# EAGLE design DotPhat (EAGLE 7.7.0)
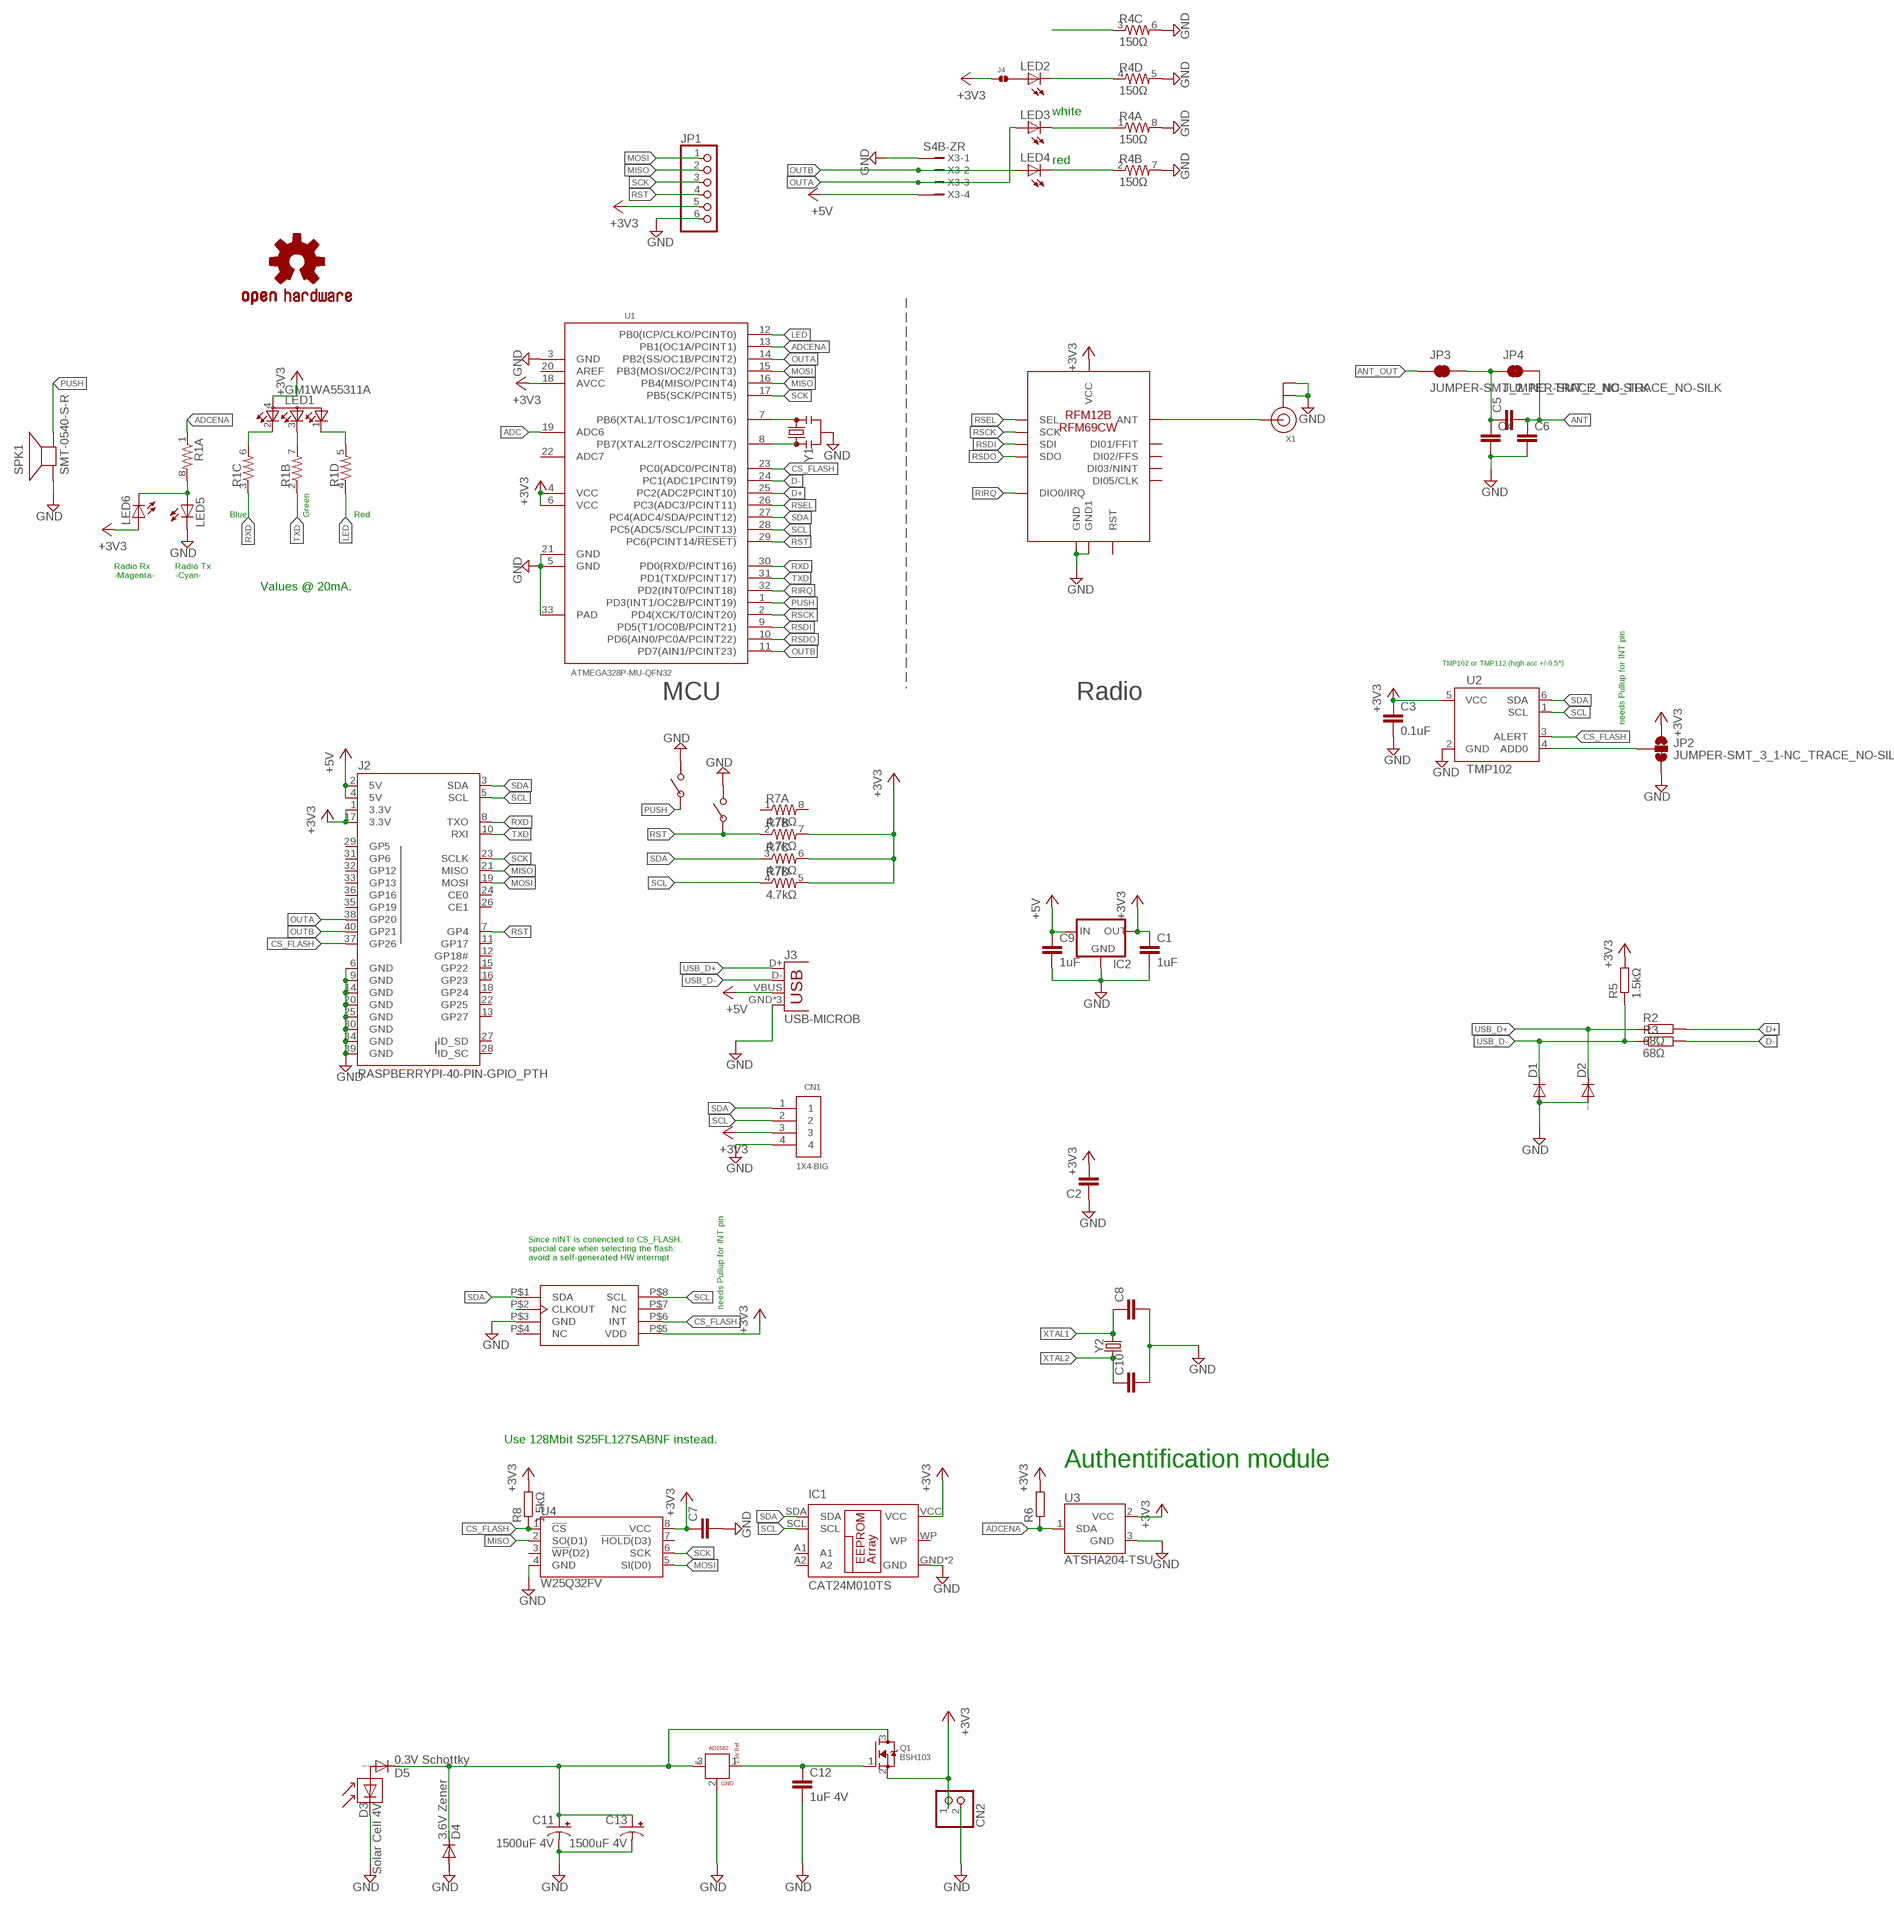
[diagram p0: schematic, sheet 1]

## Parts
C1  1uF  C-EUC0603  [C0603]
C2  C-EUC3216  [C3216]
C3  0.1uF  C-EUC0603  [C0603]
C4  C-EUC0603  [C0603]
C5  C-EUC0603  [C0603]
C6  C-EUC0603  [C0603]
C7  C-EUC0603  [C0603]
C8  C-EUC0402  [C0402]
C9  1uF  C-EUC0603  [C0603]
C10  C-EUC0402  [C0402]
C11  1500uF 4V  CPOL-USCT7343  [CT7343]
C12  1uF 4V  C-EUC0603  [C0603]
C13  1500uF 4V  CPOL-USCT7343  [CT7343]
CN1  1X4-BIG  [1X04-BIG]
CN2  JST_2PIN-SMT-RA  [JST-PH-2-SMT-RA]
D1  DIODE-SOD523  [SOD523]
D2  DIODE-SOD523  [SOD523]
D3  Solar Cell 4V  SOLAR-IXYS-  [SOLARBIT-12X1]
D4  3.6V Zener  DIODE-SOD523  [SOD523]
D5  0.3V Schottky  DIODE-SOD523  [SOD523]
IC1  CAT24M010TS  [TSSOP8]
IC2  MCP1700TT  [SOT-23]
J2  RASPBERRYPI-40-PIN-GPIO_PTH  [2X20_SHROUDED]
J3  USB-MICROB  [USB-MICROB]
J4  SOLDERJUMPER.2.MED  [2.MED]
JP1  PINHD-1X6  [1X06]
JP2  JUMPER-SMT_3_1-NC_TRACE_NO-SILK  [SMT-JUMPER_3_1-NC_TRACE_NO-SILK]
JP3  JUMPER-SMT_2_NC_TRACE_NO-SILK  [SMT-JUMPER_2_NC_TRACE_NO-SILK]
JP4  JUMPER-SMT_2_NC_TRACE_NO-SILK  [SMT-JUMPER_2_NC_TRACE_NO-SILK]
LED1  GM1WA55311A  [GM1WA55311A]
LED2  LED0603  [LED-0603]
LED3  LED0603  [LED-0603]
LED4  LED0603  [LED-0603]
LED5  LED0603  [LED-0603]
LED6  LED0603  [LED-0603]
LOGO1  OSHW-LOGOS  [OSHW-LOGO-S]
Q1  BSH103  MOSFET-NREFLOW  [SOT23]
R1  RESISTOR-ARRAY0603-ARV  [0603-ARV]
R2  68Ω  R-EU_R0603  [R0603]
R3  68Ω  R-EU_R0603  [R0603]
R4  150Ω  RESISTOR-ARRAY0603-ARV  [0603-ARV]
R5  1.5kΩ  R-EU_R0603  [R0603]
R6  R-EU_R0603  [R0603]
R7  4.7kΩ  RESISTOR-ARRAY0603-ARV  [0603-ARV]
R8  1.5kΩ  R-EU_R0603  [R0603]
SPK1  SMT-0540-S-R  [SMT-0540-S-R]
U1  ATMEGA328P-MU-QFN32  MCU-ATMEGA328P-MU(QFN32)  [QFN32G-0.5-5X5MM]
U2  TMP102  [SOT563]
U3  ATSHA204-TSU  [SOT23-3]
U4  W25Q32FV  W25Q32FVZP  [WSON8-6X5MM]
U$1  RFM12B/69CW  [RFM12B/69CW]
U$2  PUSHBUTTON_4X2.5  [PUSHBUTTON_4X2.5]
U$3  PUSHBUTTON_4X2.5  [PUSHBUTTON_4X2.5]
U$4  AD1582  [SOT23]
X1  ANTENNA_U.FL  [U.FL]
X2  MC-RTC-RV-4162-C7-I2C  [MC-RTC-C7]
X3  S4B-ZR  [S4B-ZR]
Y1  RESONATORSMD-3.2X1.3  [RESONATOR-SMD-3.2X1.3]
Y2  CRYSTALSMD-3.2X1.5  [CRYSTAL-SMD-3.2X1.5MM]

## Nets
+3V3: C1.1 C2.2 C3.1 C7.1 CN1.3 CN2.1 IC1.VCC IC2.2(OUT) J2.1(3.3V) J2.17(3.3V) J4.1 JP1.5 JP2.1 LED1.4(A) LED6.A Q1.2(S) R5.2 R6.2 R7.5 R7.6 R7.7 R8.2 U1.4(VCC) U1.6(VCC) U1.18(AVCC) U2.5(VCC) U3.2(VCC) U4.8(VCC) U$1.VDD(VCC) X2.P$5(VDD)
+5V: C9.1 IC2.3(IN) J2.2(5V) J2.4(5V) J3.VBUS X3.4
ADC: U1.19(ADC6)
ADCENA: R1.1 R6.1 U1.13(PB1(OC1A/PCINT1)) U3.1(SDA)
ANT: C5.2 C6.1 JP4.2
ANT_OUT: JP3.1 U$1.ANT X1.3(SIGNAL)
CAPS_VCC: C11.+ C13.+ D4.C D5.C Q1.3(D) U$4.3
CS_FLASH: J2.37(GP26) R8.1 U1.23(PC0(ADC0/PCINT8)) U2.3(ALERT) U4.1(!CS!) X2.P$6(INT)
D+: R2.2 U1.25(PC2(ADC2PCINT10))
D-: R3.2 U1.24(PC1(ADC1PCINT9))
GND: C1.2 C2.1 C3.2 C4.2 C6.2 C7.2 C8.2 C9.2 C10.2 C11.- C12.2 C13.- CN1.4 CN2.2 D1.A D2.A D3.-(C) D4.A IC1.GND IC1.NC(GND) IC2.1(GND) J2.6(GND) J2.9(GND) J2.14(GND) J2.20(GND) J2.25(GND) J2.30(GND) J2.34(GND) J2.39(GND) J3.GND J3.MT1(GND) J3.MT2(GND) JP1.6 JP2.3 LED5.C R4.5 R4.6 R4.7 R4.8 SPK1.-(+) U1.3(GND) U1.5(GND) U1.21(GND) U1.33(PAD) U2.2(GND) U3.3(GND) U4.4(GND) U$1.GND U$1.GND1 U$2.P$2 U$3.P$2 U$4.2 X1.1(GND) X1.2(GND) X2.P$3(GND) X3.1 Y1.2
LED: R1.4 U1.12(PB0(ICP/CLKO/PCINT0))
MISO: J2.21(MISO) JP1.2 U1.16(PB4(MISO/PCINT4)) U4.2(SO(D1))
MOSFET: C12.1 Q1.1(G) U$4.1
MOSI: J2.19(MOSI) JP1.1 U1.15(PB3(MOSI/OC2/PCINT3)) U4.5(SI(D0))
N$1: LED1.3(CBLUE) R1.7
N$2: LED3.C R4.1
N$3: C4.1 C5.1 JP3.2 JP4.1
N$4: LED1.2(CRED) R1.6
N$5: D3.+(A) D5.A
N$6: U1.7(PB6(XTAL1/TOSC1/PCINT6)) Y1.3
N$7: LED2.C R4.4
N$8: U1.8(PB7(XTAL2/TOSC2/PCINT7)) Y1.1
N$9: LED4.C R4.2
N$10: R4.3
N$11: JP2.2 U2.4(ADD0)
N$12: J4.2 LED2.A
N$13: LED5.A LED6.C R1.8
N$15: LED1.1(CGREEN) R1.5
OUTA: J2.38(GP20) LED3.A U1.14(PB2(SS/OC1B/PCINT2)) X3.3
OUTB: J2.40(GP21) LED4.A U1.11(PD7(AIN1/PCINT23)) X3.2
PUSH: SPK1.+(-) U1.1(PD3(INT1/OC2B/PCINT19)) U$3.P$1
RIRQ: U1.32(PD2(INT0/PCINT18)) U$1.IRQ(DIO0/IRQ)
RSCK: U1.2(PD4(XCK/T0/CINT20)) U$1.SCK
RSDI: U1.9(PD5(T1/OC0B/PCINT21)) U$1.SDI
RSDO: U1.10(PD6(AIN0/PC0A/PCINT22)) U$1.SDO
RSEL: U1.26(PC3(ADC3/PCINT11)) U$1.SEL
RST: J2.7(GP4) JP1.4 R7.2 U1.29(PC6(PCINT14/!RESET)) U$2.P$1
RXD: J2.8(TXO) R1.3 U1.30(PD0(RXD/PCINT16))
SCK: J2.23(SCLK) JP1.3 U1.17(PB5(SCK/PCINT5)) U4.6(SCK)
SCL: CN1.2 IC1.SCL J2.5(SCL) R7.4 U1.28(PC5(ADC5/SCL/PCINT13)) U2.1(SCL) X2.P$8(SCL)
SDA: CN1.1 IC1.SDA J2.3(SDA) R7.3 U1.27(PC4(ADC4/SDA/PCINT12)) U2.6(SDA) X2.P$1(SDA)
TXD: J2.10(RXI) R1.2 U1.31(PD1(TXD/PCINT17))
USB_D+: D2.C J3.D+ R2.1
USB_D-: D1.C J3.D- R3.1 R5.1
XTAL1: C8.1 Y2.P$2
XTAL2: C10.1 Y2.P$1
Unconnected: IC1.A1 IC1.A2 IC1.WP J2.11(GP17) J2.12(GP18#) J2.13(GP27) J2.15(GP22) J2.16(GP23) J2.18(GP24) J2.22(GP25) J2.24(CE0) J2.26(CE1) J2.27(ID_SD) J2.28(ID_SC) J2.29(GP5) J2.31(GP6) J2.32(GP12) J2.33(GP13) J2.35(GP19) J2.36(GP16) R7.1 R7.8 U1.20(AREF) U1.22(ADC7) U4.3(!WP!(D2)) U4.7(!HOLD!(D3)) U$1.CLK(DI05/CLK) U$1.FFIT(DI01/FFIT) U$1.FFS(DI02/FFS) U$1.NINT(DI03/NINT) U$1.RST X2.P$2(CLKOUT) X2.P$4(NC) X2.P$7(NC)

## Notes on the sheet
- white
- red
- Blue | Green | Red
- Radio Rx
  -Magenta-
- Radio Tx
  -Cyan-
- Values @ 20mA.
- TMP102 or TMP112 (high acc +/-0.5°)
- MCU | Radio
- needs Pullup for INT pin
- Since nINT is conencted to CS_FLASH,
  special care when selecting the flash:
  avoid a self-generated HW interrupt
- needs Pullup for INT pin
- Use 128Mbit S25FL127SABNF instead.
- Authentification module

## Library data of the parts
C1 C2 C4-C10 C12 = rcl:C-EU: CAPACITOR, European symbol
C3 = resistor:C-EU: CAPACITOR, European symbol
C11 C13 = adafruit:CPOL-US: POLARIZED CAPACITOR, American symbol
CN1 = adafruit:1X4: 4-pin connector
CN2 = adafruit:JST_2PIN: JST 2-Pin Connectors of various flavors SMT-RA (S2B-PH-SM4) 4UConnector #17311 SMT (B2B-PH-SM4) THM-RA (S2B-PH) THM (B2B-PH)
D1 D2 D4 D5 = diode:DIODE-: DIODE
D3 = SparkFun:SOLAR-IXYS
IC1 = CAT24M01YI:CAT24M01: Serial EEPROM 1Mb, I2C; MF: On Semiconductor; MPN: 24C00T-E/ST
IC2 = MCP1700:MCP1700: Microchip MCP1700 positive regulator
J2 = SparkFun-Connectors:RASPBERRYPI-40-PIN-GPIO: Raspberry Pi GPIO Header 2x20 pin connector, as found on B, B+, A+ models. Both shrouded PTH and SMT versions available. SparkFun Products: GPIO Shrouded Header <https://www.sparkfun.com/products/13054>- PTH SparkFun Pi Wedge (Preassembled) <https://www.sparkfun.com/products/13717>; PROD_ID: CONN-12263; SF_ID: PRT-13054
J3 = SparkFun-Retired:USB: USB Connectors USB-B-PTH is fully proven SKU : PRT-00139/CONN-08278 USB-miniB is fully proven SKU : PRT-00587 USB-A-PCB is untested. USB-A-H is throughly reviewed, but untested. Spark Fun Electronics SKU : PRT-00437 USB-B-SMT is throughly reviewed, but untested. Needs silkscreen touching up. USB-A-S has not been used/tested USB-MB-H has not been used/tested USB-MICROB has been used. CONN-09505; PROD_ID: CONN-09505
J4 = solderjumper:SOLDERJUMPER.2
JP1 = adafruit:PINHD-1X6: PIN HEADER
JP2 = SparkFun-Jumpers:JUMPER-SMT_3_1-NC_TRACE: Normally closed trace jumper (1 of 2 connections) This jumper has a trace between two pads so it's normally closed (NC). The other connection is normally open (NO). Use a razor knife to open the connection. For best results follow the IPC guidelines for cutting traces: Cutout at least 0.063 mm (0.005 in). Remove all loose material to clean up the cut area. Seal the cut with an approved epoxy. Reapply solder to reclose the connection, or to close the NO connection.
JP3 JP4 = SparkFun-Jumpers:JUMPER-SMT_2_NC_TRACE: Normally closed trace jumper This jumper has a trace between two pads so it's normally closed (NC). Use a razor knife to open the connection. For best results follow the IPC guidelines for cutting traces: Cutout at least 0.063 mm (0.005 in). Remove all loose material to clean up the cut area. Seal the cut with an approved epoxy. Reapply solder to reclose the connection.
LED1 = led:GM1WA55311A: Chip LED RGB Source: http://document.sharpsma.com/files/GM1WA55311A_SS.pdf
LED2-LED6 = SparkFun:LED: LEDs Standard schematic elements and footprints for 5mm, 3mm, 1206, and 0603 sized LEDs. 5mm - Spark Fun Electronics SKU : COM-00529 (and others)
LOGO1 = Spark:OSHW-LOGO: Open Source Hardware Logo This logo indicates the piece of hardware it is found on incorporates a OSHW license and/or adheres to the definition of open source hardware found here: http://freedomdefined.org/OSHW
Q1 = adafruit:MOSFET-N: N-Channel Mosfet 2N7002E - 60V 260mA SOT23 [Digikey: 2N7002ET1GOSTR-ND] - REEL BSH103 - 30V 850mA SOT23 [Digikey: 568-5013-1-ND]
R1 R4 R7 = SparkFun:RESISTOR-ARRAY: Array Chip Resistor Source: RS Component / Phycomp
R2 R3 R5 R6 R8 = rcl:R-EU_: RESISTOR, European symbol
SPK1 = adafruit:SMT-0540-S-R: SMT-0549-S-R Small surface-mount magnetic buzzer
U1 = Seeed-OPL-ic:MCU-ATMEGA328P-MU(QFN32): 310010005; MPN: ATMEGA328P-MU
U2 = SparkFun:TMP102
U3 = SparkFun-IC-Special-Function:ATSHA204: Atmel ATSHA204 The Atmel ATSHA204 is an optimized authentication chip that includes a 4.5Kb EEPROM. This array can be used for storage of keys, miscellaneous read/write, read-only, password or secret data, and consumption tracking. Access to the various sections of memory can be restricted in a variety of ways and then the configuration locked to prevent changes. Datasheet <http://www.atmel.com/Images/Atmel-8740-CryptoAuth-ATSHA204-Datasheet.pdf> SparkFun Products SparkFun Electric Imp Shield <https://www.sparkfun.com/products/12887> SparkFun Electric Imp Breakout <https://www.sparkfun.com/products/12886>; PROD_ID: IC-11208
U4 = SparkFun-IC-Memory:W25Q32FV: W25Q32FV 32Mb (4MB) Serial Flash Memory The W25Q32FV support the standard Serial Peripheral Interface (SPI), Dual/Quad I/O SPI as well as 2-clocks instruction cycle Quad Peripheral Interface (QPI). 104MHz, SPI, 8-SOIC-EIAJ Datasheet <http://www.winbond.com/resource-files/w25q32fv%20revh%20091613.pdf> SparkFun Products SparkFun Blynk Board - ESP8266 <https://www.sparkfun.com/products/13794> (WRL-13794); PROD_ID: NA-XXXXX
U$1 = rfm12b_withoutPlanes:RFM12B/69CW
U$2 U$3 = pusbbutton_4x2_5:PUSHBUTTON_4X2.5
U$4 = AD1582:AD1582
X1 = adafruit:ANTENNA_U.FL: U.FL Antenna Connector
X2 = Microcrystal-RTC:MC-RTC-RV-4162-C7-I2C: Microcrystal RV-4162-C7 Real Time Clock Module with I2C Bus Ultra small SMT ceramic package with integrated 32.768kHz Crystal Automotive qualified, according to AEC-Q200 Rev. C I2C Interface Address: D0h Frequency-Offset Trimming Register Programmable Alarm and Interrupt Oscillator Fail Detection Watchdog Timer Programmable Clock-Output Time keeping mode down to 1.0 V
X3 = con-jst:?4B-ZR: ZH CONNECTOR 1.5 mm, 4 pin 1 row Source: http://www.jst.com .. eZH.pdf; MF: FARNELL; MPN: S4B-ZR(LF)(SN); OC_FARNELL: 9491830; OC_NEWARK: 38K8076
Y1 = SparkFun-Clocks:RESONATOR: Resonators (Generic) Ceramic resonators are clock-generating components, often used to control timing in microcontrollers. They usually have 3 pins: two pins for oscillation, and one pin for ground. Compared to crystals, resonators have worse tolerance, but are usually much cheaper. Plus, they have built-in load capacitors! These devices are used on boards like the Arduino Pro 8MHz <https://www.sparkfun.com/products/11114> and Arduino Pro 16MHz <https://www.sparkfun.com/products/11113>.
Y2 = SparkFun-Clocks:CRYSTAL: Crystals (Generic) These are passive quartz crystals, which can be used as a clock source for a microcontroller. Crystal's are two-terminal devices. They require external "load" capacitors to generate an oscillating signal.

## Board
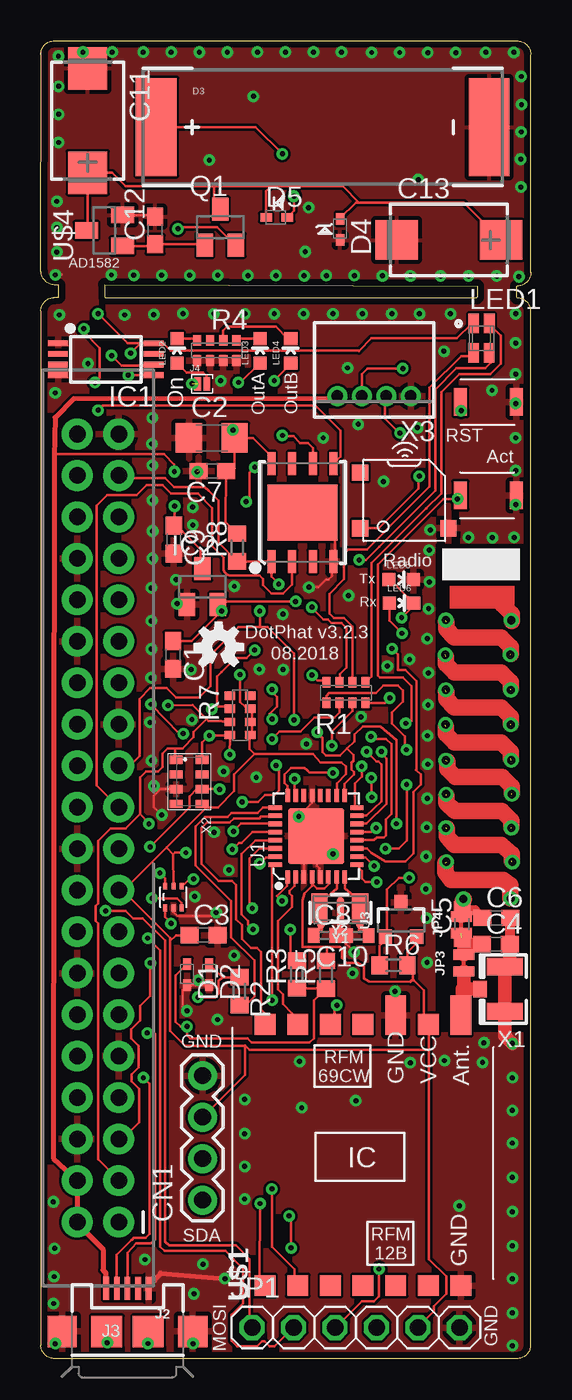
[diagram p1: board, top side]
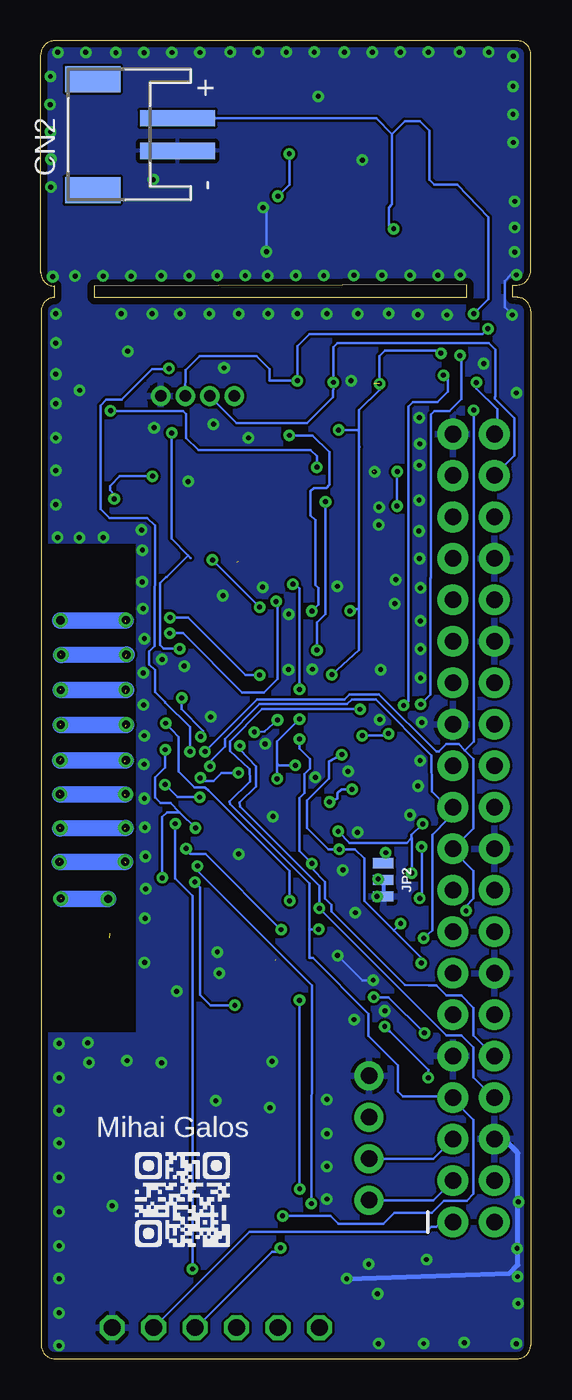
[diagram p2: board, bottom side, seen from below]

Size 30.03 x 80.72 mm. Coordinates in mm from the lower left corner, seen from the top.
Outline: 30.01,0.84 arc-90 29.18,0 0.85,0 arc-90 0.01,0.83 0.01,64.16 arc-90 0.83,65
Outline: 29.17,65 arc-90 30.01,64.17 30.01,0.84
Outline: 26.72,65 3.93,65 3.93,65.77
Outline: 3.93,65.77 26.75,65.69
Outline: 0.83,80.72 29.18,80.72
Outline: 0,79.88 arc-90 0.83,80.72
Outline: 0.83,80.72 arc0 1.03,80.72
Outline: 0.91,65.76 arc-90 0.01,66.59
Outline: 30.02,66.53 arc-90 29.2,65.69 29.16,65.69 29.16,65 29.18,65
Outline: 29.18,80.72 arc-90 30.02,79.89
Outline: 30.02,66.53 30.03,79.88
Outline: 0.01,66.58 0.01,80.03
Outline: 0.81,65 1.1,65 1.1,65.76
Outline: 26.74,65.69 26.74,65 26.71,65
Outline: 1.11,65.76 0.91,65.76 0.91,65.77
Copper layers (1*16): Top 0.035mm / dielectric 1.5mm / Bottom 0.035mm
Design rules "Mihai_default *": minimum track width 6mil, minimum drill 0.3mm, track to track 6mil, track to pad 6mil, pad to pad 6mil, via to via 6mil, smd to smd 6mil, copper to edge 16mil, drill to drill 8mil, minimum pad ring 10mil, minimum via ring 8mil, stop-mask expansion 4mil, vias tented up to drill 0mil, thermal gap 10mil
tRestrict: area 24.2,20 to 30,49.9
bRestrict: area 24.2,20 to 30.1,49.9
vRestrict: area 14,28.7 to 19.8,34.9

### Footprints (pad centres in the part's own frame; a part is rotated, then mirrored left to right if it is on the bottom)
C0603 = smd 1.1 x 1: 1 -0.85,0; 2 0.85,0
C3216 = smd 1.6 x 1.8: 1 -1.4,0; 2 1.4,0
C0402 = smd 0.7 x 0.9: 1 -0.65,0; 2 0.65,0
CT7343 = smd 2.6 x 2.4: + 3.2,0; - -3.2,0
1X04-BIG = drill 1.016 pad 1.778: 1 0,0; 2 2.54,0; 3 5.08,0; 4 7.62,0
JST-PH-2-SMT-RA = smd 1 x 4.6: 1 1,-3.7; 2 -1,-3.7 | smd 1.6 x 3.4: NC1 -3.4,1.5; NC2 3.4,1.5
SOD523 = smd 0.7 x 0.5: A 0.7,0; C -0.6,0
SOLARBIT-12X1 = smd 2.5 x 6: + -10.2,0; - 10.2,0
TSSOP8 = smd 1.2 x 0.35: A1 -2.925,1.595; A2 -2.925,0.945; GND -2.925,0.295; NC -2.925,2.245; SCL 2.925,0.945; SDA 2.925,0.295; VCC 2.925,2.245; WP 2.925,1.595
SOT-23 = smd 1 x 1.4: 1 -0.95,-1.1; 2 0.95,-1.1; 3 0,1.1
2X20_SHROUDED = drill 1.016 pad 1.88: 1 -1.27,24.13; 2 1.27,24.13; 3 -1.27,21.59; 4 1.27,21.59; 5 -1.27,19.05; 6 1.27,19.05; 7 -1.27,16.51; 8 1.27,16.51; 9 -1.27,13.97; 10 1.27,13.97; 11 -1.27,11.43; 12 1.27,11.43; 13 -1.27,8.89; 14 1.27,8.89; 15 -1.27,6.35; 16 1.27,6.35; 17 -1.27,3.81; 18 1.27,3.81; 19 -1.27,1.27; 20 1.27,1.27; 21 -1.27,-1.27; 22 1.27,-1.27; 23 -1.27,-3.81; 24 1.27,-3.81; 25 -1.27,-6.35; 26 1.27,-6.35; 27 -1.27,-8.89; 28 1.27,-8.89; 29 -1.27,-11.43; 30 1.27,-11.43; 31 -1.27,-13.97; 32 1.27,-13.97; 33 -1.27,-16.51; 34 1.27,-16.51; 35 -1.27,-19.05; 36 1.27,-19.05; 37 -1.27,-21.59; 38 1.27,-21.59; 39 -1.27,-24.13; 40 1.27,-24.13
USB-MICROB = smd 0.35 x 1.4: D+ 0,2.65; D- -0.65,2.65; GND 1.3,2.65; ID 0.65,2.65; VBUS -1.3,2.65 | smd 1.8 x 1.9: MT1 -4,0; MT2 4,0 | smd 1.9 x 1.9: P$1 -1.27,0; P$2 1.27,0
2.MED = smd 0.406 x 0.813: 1 -0.279,0; 2 0.279,0
1X06 = drill 1.016 octagon: 1 -6.35,0; 2 -3.81,0; 3 -1.27,0; 4 1.27,0; 5 3.81,0; 6 6.35,0
SMT-JUMPER_3_1-NC_TRACE_NO-SILK = smd 0.635 x 1.27: 1 -1.016,0; 2 0,0; 3 1.016,0
SMT-JUMPER_2_NC_TRACE_NO-SILK = smd 0.635 x 1.27: 1 -0.508,0; 2 0.508,0
GM1WA55311A = smd 0.65 x 1.2: 1 0.477,0.9; 2 -0.475,-0.9; 3 0.475,-0.9; 4 -0.477,0.9
LED-0603 = smd 0.8 x 0.8: A 0,-0.75; C 0,0.75
SOT23 = smd 1 x 1.4: 1 -0.95,-1.1; 2 0.95,-1.1; 3 0,1.1
0603-ARV = smd 0.5 x 0.65: 1 -1.2,-0.625; 2 -0.4,-0.625; 3 0.4,-0.625; 4 1.2,-0.625; 5 1.2,0.625; 6 0.4,0.625; 7 -0.4,0.625; 8 -1.2,0.625
R0603 = smd 1 x 1.1: 1 -0.85,0; 2 0.85,0
SMT-0540-S-R = smd 1 x 1: + 1.7,-2.7; - 1.7,2.7; M -1.7,-2.7
QFN32G-0.5-5X5MM = smd 0.813 x 0.279: 1 -2.5,1.75; 2 -2.5,1.25; 3 -2.5,0.75; 4 -2.5,0.25; 5 -2.5,-0.25; 6 -2.5,-0.75; 7 -2.5,-1.25; 8 -2.5,-1.75; 17 2.5,-1.75; 18 2.5,-1.25; 19 2.5,-0.75; 20 2.5,-0.25; 21 2.5,0.25; 22 2.5,0.75; 23 2.5,1.25; 24 2.5,1.75 | smd 0.279 x 0.813: 9 -1.75,-2.5; 10 -1.25,-2.5; 11 -0.75,-2.5; 12 -0.25,-2.5; 13 0.25,-2.5; 14 0.75,-2.5; 15 1.25,-2.5; 16 1.75,-2.5; 25 1.75,2.5; 26 1.25,2.5; 27 0.75,2.5; 28 0.25,2.5; 29 -0.25,2.5; 30 -0.75,2.5; 31 -1.25,2.5; 32 -1.75,2.5 | smd 3.429 x 3.429: 33 0,0
SOT563 = smd 0.25 x 0.4: 1 -0.5,-0.66; 2 0,-0.66; 3 0.5,-0.66; 4 0.5,0.66; 5 0,0.66; 6 -0.5,0.67
SOT23-3 = smd 0.8 x 0.9: 1 -0.95,-1; 2 0.95,-1; 3 0,1.1
WSON8-6X5MM = smd 0.5 x 1.4: 1 -1.905,-3; 2 -0.635,-3; 3 0.635,-3; 4 1.905,-3; 5 1.905,3; 6 0.635,3; 7 -0.635,3; 8 -1.905,3 | smd 4.3 x 3.4: EP 0,0
RFM12B/69CW = smd 2.413 x 1.27: ANT 9.06,-6; GND 9.06,-2 | smd 1.27 x 1.27: CLK -7.5,-2; FFIT -7.5,0; FFS -7.5,2; GND1 -7.5,-6; IRQ -7.5,4; NINT 8.5,0; RST -7.5,-4; SCK 8.5,4; SDI 8.5,2; SDO -7.5,6; SEL 8.5,6; VDD 8.5,-4
PUSHBUTTON_4X2.5 = smd 0.8 x 1.7: P$1 -1.27,0; P$2 2.159,0
U.FL = smd 2.2 x 1.05: 1 0,1.375; 2 0,-1.375 | smd 0.8 x 1: 3 1.525,0
MC-RTC-C7 = smd 0.5 x 0.8: P$1 -1.35,-0.8; P$2 -0.45,-0.8; P$3 0.45,-0.8; P$4 1.35,-0.8; P$5 1.35,0.8; P$6 0.45,0.8; P$7 -0.45,0.8; P$8 -1.35,0.8
S4B-ZR = drill 0.7 pad 1.1: 1 -2.25,0; 2 -0.75,0; 3 0.75,0; 4 2.25,0
RESONATOR-SMD-3.2X1.3 = smd 0.45 x 1.905: 1 -1.2,0; 2 0,0; 3 1.2,0
CRYSTAL-SMD-3.2X1.5MM = smd 1 x 1.8: P$1 -1.25,0; P$2 1.25,0

### Placement (x,y rotation side)
C1  8.11,43.11 270 top
C2  10.47,56.39 0 top
C3  9.97,25.94 0 top
C4  27.89,25.38 0 top
C5  25.81,26.62 90 top
C6  27.91,27 0 top
C7  10.51,54.37 180 top
C8  17.38,25.93 0 top
C9  8.15,50.17 270 top
C10  19.44,25.92 180 top
C11  2.88,75.83 270 top
C12  7,69.1 90 top
C13  25.01,68.52 0 top
CN1  9.91,9.71 90 top
CN2  25.34,74.97 90 bottom
D1  8.97,23.57 270 top
D2  10.32,23.57 270 top
D3  17.27,75.44 0 top
D4  18.34,69.21 270 top
D5  14.41,69.9 0 top
IC1  3.99,59.94 0 top
IC2  9.91,47.29 0 top
J2  3.5,32.5 180 top
J3  5.31,1.66 0 top
J4  9.89,59.71 0 top
JP1  19.3,1.9 0 top
JP2  9.05,29.33 270 bottom
JP3  25.92,24.23 90 top
JP4  25.78,26.57 90 top
LED1  27,62.5 0 top
LED2  8.35,61.72 0 top
LED3  13.42,61.74 0 top
LED4  15.32,61.73 0 top
LED5  22.07,47.71 270 top
LED6  22.1,46.29 270 top
LOGO1  10.91,43.6 0 top
Q1  11.01,69.3 0 top
R1  18.7,40.8 0 top
R2  12.17,22.51 270 top
R3  15.69,23.54 90 top
R4  10.78,61.75 180 top
R5  17.47,23.51 90 top
R6  21.61,24.1 0 top
R7  12.21,39.4 270 top
R8  12.04,49.69 90 top
SPK1  22.27,52.57 270 top
U1  16.88,32 90 top
U2  8.13,28.27 0 top
U3  22.08,26.84 0 top
U4  16.04,51.82 0 top
U$1  19.74,11.97 90 top
U$2  26.98,58.6 0 top
U$3  26.98,52.88 0 top
U$4  3.9,69.1 90 top
X1  28.44,22.64 180 top
X2  9.1,35.33 270 top
X3  20.43,58.96 180 top
Y1  18.36,27.31 180 top
Y2  18.32,27.6 180 top

### Tracks (layer width: path | path; a pad name or v marks a point on that pad's centre or on a via)
+3V3  (via drill 0.3)  (1 unrouted)
  Top 0.152: U1.6 17.68,29.42 17.68,29.11 17.38,28.81 16.92,28.81 16.62,29.11 16.62,29.42 U1.4 16.61,29.49 16.61,28.95 16.16,28.5 16.02,28.05 16.03,25.22 16.65,25.21 17.54,25.21 | 23.78,18.9 23.78,6.1 24.85,5.03 24.85,3.96 24.08,3.2 24.08,2.9 23.17,1.98 JP1.5 | 23.78,18.9 23.78,20.42 U$1.VDD 23.63,20.58 23.47,20.73 23.47,22.56 22.86,23.17 22.72,23.17 | LED1.4 26.52,63.55 26.37,63.71 26.37,63.37 25.5,62.5 20.26,62.5 19.48,61.72 19.48,61.73 7.94,61.73 7.48,62.19 IC1.VCC | 13.11,37.04 16.01,37.04 16.01,37.03 16.68,37.03 17.15,36.52 18.41,36.52 18.71,36.27 18.71,35.81 18.14,35.24 18.14,34.6 U1.18 | 13.11,37.04 12.81,37.34 12.81,38.1 R7.5 12.96,38.25 12.96,38.86 R7.6 12.96,39.02 12.96,39.78 R7.7 12.81,39.93 12.5,39.93 12.2,40.24 v12.2,41.9 | 4.88,28.81 5.19,28.81 7.7,31.32 | 10.15,33.77 7.7,31.32 | 23.78,18.9 12.81,18.9 12.51,19.19 | 7.93,25.58 7.93,25.76 4.88,28.81 | 4.88,28.81 J2.17 | CN1.3 12.51,17.39 12.51,19.19 | U2.5 8.12,30.9 | 8.12,30.9 7.7,31.32 | C3.1 8.29,25.94 7.93,25.58 | v8.89,30.99 8.22,30.99 8.12,30.9 | 17.54,25.21 18.33,25.21 18.46,25.07 18.46,24.54 18.75,24.25 19.41,24.25 19.81,24.01 19.81,23.28 20.1,23.1 22.65,23.09 22.72,23.17 | 7.93,25.58 7.93,20.07 8.84,19.16 12.48,19.16 12.51,19.19 | U3.2 23.14,25.55 22.46,24.88 R6.2 22.79,23.76 22.79,23.24 22.72,23.17 | C2.2 11.87,56.75 v11.78,56.88 | R5.2 arc90 17.54,24.43 17.54,25.21 | R8.2 11.34,51.24 C7.1 11.87,54.51 C2.2 | C2.2 12.99,56.39 14.13,55.25 U4.8 | X2.P$5 9.94,33.98 10.15,33.77 | 10.15,33.77 10.87,33.77 11.86,34.76 11.86,35.78 13.11,37.04 | C1.1 9.24,43.96 v11.08,45.8 10.86,46.02 IC2.2 11.04,46.38 v15.61,46.38
  Top 0.152: J4.1 | v5.5,61.58 6.12,62.19 IC1.VCC | LED6.A 21.35,45.21 v22.13,44.43 | IC1.VCC 5.32,62.19 v3.5,64 | Q1.2 11.91,68.2 10.81,69.3 8.51,69.3 v8.41,69.2
  Bottom 0.152: JP1.5 23.02,1.98 17.23,7.77 6.41,7.77 6.1,8.08 5.8,8.08 5.64,8.23 4.88,8.23 J2.1 | v12.2,41.9 10.55,43.39 10.52,45.9 | 10.52,45.9 10.52,55.86 | 10.52,55.86 10.52,57.83 | 10.52,57.83 10.52,58.09 9.25,59.34 9.25,59.69 v9.27,59.72 9.27,61.4 8.94,61.73 5.66,61.73 v5.5,61.58 | v11.08,45.8 11.03,45.8 11.03,45.9 10.52,45.9 | JP2.1 9.05,30.83 v8.89,30.99 | 10.52,55.85 10.51,55.85 10.52,55.86 | v11.78,56.88 10.53,56.88 10.52,57.83 | v22.13,44.43 21.32,44.43 17.7,40.81 16.36,40.81 15.53,41.64 15.53,46.3 v15.61,46.38 | v3.5,64 2.6,64.9 2.6,69.9 4.5,71.9 5.91,71.9 6.21,72.2 6.21,75.2 6.8,75.8 7.71,75.8 8.51,75 | 8.51,75 8.51,70.7 8.71,70.5 8.71,69.4 v8.41,69.2 | CN2.1 9.48,75.97 8.51,75
+5V  (via drill 0.3)
  Top 0.152: v8.18,54.33 8.18,54.76 7.55,55.4 0.91,55.4 0.83,55.23 | v8.2,52.22 8.21,50.61 8.15,50.61 C9.1 8.52,50.65 8.69,50.65 9.78,49.56 9.78,48.51 | 9.77,48.52 9.78,48.51 | 9.78,48.51 IC2.3
  Top 0.305: X3.4 18.15,59.37 17.56,58.78 2,58.8 0.88,57.64 0.83,55.23 0.77,12.27 J2.4 J2.2 2.23,7.73 2.78,7.73 3.81,6.7 3.81,5.42 3.98,5.25 3.98,4.34 J3.VBUS
  Bottom 0.152: v8.2,52.22 8.21,54.31 v8.18,54.33
ADCENA  (via drill 0.3)
  Top 0.152: U1.13 20.22,32.25 v20.55,32.51 | U3.1 21.21,25.72 | 21.21,25.72 21.22,28.73 21.94,29.45 v22.59,29.45 | 21.21,25.72 20.76,25.27 R6.1 | v22.41,37.3 22.3,37.4 22.3,38.12 21.52,38.9 21.52,39.59 22.19,40.25 22.19,40.94 21.89,41.23 21,41.23 20.54,40.77 17.67,40.77 17.5,40.6 R1.1
  Bottom 0.152: 20.62,32.51 v20.55,32.51 21.52,33.47 | v22.59,29.45 22.59,33.18 22.29,33.47 21.52,33.47 | 21.52,33.47 22.08,34.03 22.68,34.03 23.02,34.38 23.02,35.6 22.41,36.21 v22.41,37.3
ANT  (via drill 0.3)  (16 unrouted)
  Top 0.61: C6.1 26.6,27.47 C5.2 25.81,28.09 v25.9,28.17
  Top 0.813: JP4.2 25.78,28.05 v25.9,28.17
  Top 1: 24.8,30.38 24.8,29.77 25.13,29.33 28.34,29.33 28.77,29.02 28.77,28.46 28.78,28.18 | 28.85,30.49 28.85,30.91 28.22,31.46 25.34,31.46 24.88,32 24.88,32.45 24.87,32.46 | 28.84,32.54 28.84,32.95 28.25,33.53 25.38,33.53 24.87,34.04 24.87,34.5 24.86,34.51 | 28.87,34.62 28.87,35.03 28.29,35.61 25.41,35.61 24.9,36.12 24.9,36.58 24.89,36.59 | 28.79,36.75 28.79,37.16 28.21,37.74 25.33,37.74 24.82,38.25 24.82,38.71 24.81,38.72 | 28.81,38.89 28.81,39.3 28.23,39.88 25.35,39.88 24.84,40.39 24.84,40.85 24.83,40.86 | 28.8,41.03 28.8,41.44 28.22,42.02 25.34,42.02 24.83,42.53 24.83,42.99 24.82,43 | 28.81,43.17 28.81,43.59 28.23,44.17 25.35,44.17 24.84,44.68 24.84,45.13 24.83,45.14
  Bottom 1: 24.87,30.43 28.88,30.41 | 24.83,32.5 28.84,32.49 | 24.85,34.57 28.86,34.56 | 24.83,36.65 28.84,36.64 | 24.8,38.82 28.8,38.81 | 24.8,40.96 28.8,40.95 | 24.78,43.11 28.79,43.1 | 24.82,45.22 28.83,45.21 | v25.9,28.17 28.75,28.17
ANT2
  Top 1: 28.88,45.2 28.88,45.61 28.3,46.19
ANT_OUT
  Top 0.813: X1.3 25.82,22.66 | 25.82,22.66 25.82,21.11 U$1.ANT | JP3.1 25.92,22.76 25.82,22.66
CAPS_VCC
  Top 0.152: 19.5,70.8 19.3,70.8 18.34,69.84 D4.C | 19.5,70.8 25.93,70.8 C13.+ | 10.61,71.8 5.21,71.8 4.38,72.63 C11.+ 2.88,69.1 U$4.3 | 10.61,71.8 14.11,71.8 | 14.11,71.8 18.5,71.8 19.5,70.8 | 14.11,71.8 13.81,71.5 D5.C | Q1.3 10.61,70.4 10.61,71.8
CS_FLASH  (via drill 0.3)
  Top 0.152: v15.55,35.51 15.55,34.6 U1.23 | v14.18,39.17 14.03,39.32 14.03,39.47 14.48,39.93 14.48,40.54 14.18,40.85 v14.18,41 | v14.59,47.44 14.13,47.89 U4.1 14.12,48.84 R8.1 | v10.96,34.87 v10.95,34.88 X2.P$6 9.54,34.88 9.11,34.45 9.11,33.77 v6.69,31.35 | 12.08,34.1 v12.34,34.1 13.33,34.1 13.75,34.52 14.32,34.52 14.61,34.81 14.61,36.16 v14.43,36.34 | U2.3 8.62,27.92 8.34,28.2 v6.8,28.2 | R8.1 12.04,48.93 | J2.37 4.92,53.94 7.61,53.94 8.16,53.4 10.04,53.4 10.28,53.16 10.29,53.16 10.89,52.56 10.89,49.99 R8.1
  Bottom 0.152: 15.55,36.5 15.55,37.8 v14.18,39.17 | 15.55,36.5 v15.55,35.51 | v14.18,41 | 14.19,41 v14.18,41 | v14.18,41 14.18,47.17 14.45,47.44 v14.59,47.44 | v10.96,34.87 11.61,34.87 11.85,34.64 11.85,34.31 v12.34,34.1 | v14.43,36.34 15.4,36.34 15.55,36.5 | v6.69,31.35 6.69,28.31 v6.8,28.2
D+
  Top 0.152: R2.2 12.59,21.66 13.1,22.18 13.1,24.39 11.66,25.81 11.65,28.03 9.5,30.21 9.5,32.6 10.07,33.18 11.45,33.18 11.7,33.43 13.3,33.43 13.62,33.75 U1.25
D-  (via drill 0.3)  (1 unrouted)
  Top 0.152: 20.9,31.25 v21.13,31.25 21.94,31.26 22.42,31.75 v22.42,35.16 | v17.91,35.88 v17.91,35.89 16.46,35.89 16.36,35.99 16.3,36.04 | v20.26,35.58 20.26,34.41 v20.29,34.39 | 15.64,24.45 arc-90 15.3,24.79 v15.3,26.27 | 16.3,36.04 16.3,36.05 | U1.24 15.12,35.06 14.93,35.26 14.93,35.78 15.33,36.18 16.17,36.18 16.3,36.04
  Bottom 0.152: v21.13,31.25 20.9,30.95 20.85,30.9 19.93,30.9 v15.3,26.27 | v17.91,35.88 18.94,35.88 19.43,35.39 20.07,35.39 v20.26,35.58 | v20.29,34.39 21.65,34.4 v22.42,35.16
GND  (via drill 0.3)  (2 unrouted)
  Top 0.152: 16.92,30.9 16.92,30.18 17.07,30.03 17.07,29.57 U1.5 | 16.92,30.9 16.92,31 | 16.92,31 16.92,31.85 U1.33 15.81,33.07 v15.81,33.2 16.62,34.02 U1.21 | U1.3 16.12,30.92 16.2,31 16.92,31 | v17.9,30.9 16.92,30.9 | D1.A D2.A | D1.A 9.35,22.87 v9.66,23.18 | v8.95,21.3 8.68,21.3 8.68,22.58 D1.A | 18.36,26.29 18.34,25.77 | 18.34,25.77 v19.21,24.9 | C10.2 18.78,25.89 C8.2 18.14,25.77 18.34,25.77 | v16.43,47.25 17.02,47.25 17.49,47.72 17.61,47.72 17.84,47.94 17.84,48.72 U4.4 | 16.04,51.82 16.64,51.82 17.8,50.65 17.83,50.65 18.02,50.46 18.02,48.77 17.9,48.64 | X2.P$3 7.34,34.88 6.91,34.45 6.91,33.8 v7.41,33.3 | U2.2 8.12,27.35 8.38,27.13 10.51,27.12 v10.75,27.32 | 23.49,45.92 23.72,45.92 | 1.28,66.38 v0.89,66.38 | 16.22,70.5 v16.4,70.5 | U$4.2 6.91,70.05 C12.2
  Top 0.305: J3.GND 7.33,5.23 v11.28,4.9
  Top 0.61: C6.2 28.75,26.99 C4.2 28.77,25.4
  Top 0.813: 28.77,25.4 28.74,24.06 X1.2 X1.1 28.45,19.76 v28.9,19.3
  Bottom 0.152: JP2.3 v9.43,28.31 v9.43,28.3 | v9.66,23.18 10.33,23.18 v11.85,24.69 | v1.14,63.93 1.6,64.4 1.6,66 1.22,66.38 v0.89,66.38 | v16.4,70.5 16.2,70.4 v16.2,67.8
  Bottom 0.305: v11.28,4.9 1.3,5.23 0.79,5.74 0.79,12.6 1.64,13.45 J2.6
  other vias: 13.21,35.6 11.2,35.97 9.21,42.2 24.74,18.26 22.64,18.12 21.7,22.5 19.3,15.8 28.9,17.2 28.9,15.2 28.9,13.2 28.9,11.1 28.9,9 28.9,6.9 28.9,4.9 28.9,2.8 28.9,0.8 23.67,24.26 23.64,26.97 23.61,28.78 23.62,30.76 23.65,32.54 23.69,34.31 23.71,36.41 23.7,38.16 23.73,40.05 23.75,42 23.69,44.1 23.8,49.52 23.86,50.75 29.11,62.2 29.11,60.3 29.11,58.5 29.11,56.4 29,50.3 26.2,50.3 29.11,52.3 29.11,64 29.11,54.4 27.07,18.14 15.86,18.21 10.61,64 12.51,64 14.31,64 16.11,64 17.9,64 19.7,64 21.5,64 23.2,64 25.11,64 24.7,61.7 5.14,63.93 17.3,56.4 9.31,52.16 11.53,29.93 10.83,20.77 19.1,23.6 9.33,0.92 0.89,0.92 0.82,5.03 0.84,6.76 27.15,19.35 27.66,59.31 23.09,57.03 21,53.73 19.45,57.24 8.71,64.01 6.92,63.96 6.68,38.97 6.75,41.7 6.76,43.47 6.76,45.19 6.76,47.21 12.5,15.87 12.5,13.77 12.5,11.77 12.5,9.77 9.32,51.06 6.85,52.59 6.83,57.64 18.86,46.74 21.24,42.42 6.78,36.64 9.25,39.14 16.28,37.66 14.85,42.2 10.62,32.24 11.02,59.9 6.8,56.04 4.08,0.98 6.57,0.93 0.78,3.38 0.77,9.61 15.99,15.37 9.58,54.32 0.88,59.16 2.89,60.95 6.39,6.07 9.39,3.97 6.85,50.69 6.83,49.01 14.84,45.6 27.68,50.29 6.92,35.08 6.83,54.72 18.8,60.69 25.65,9.36 9.94,5.79 8.28,47.71 8.34,46.24 23.82,47.58 23.77,45.93 22.6,42.83 19.62,39.31 11.86,47.31 13.39,42.23 6.28,80.02 8,80.02 20.27,80 21.99,80 29.44,78.53 29.46,76.81 29.44,75.14 29.4,73.47 29.42,71.76 29.3,66.27 23.71,80 25.43,80 13.28,80.03 14.99,80.03 27.27,80.01 28.98,80.01 12.7,66.34 14.41,66.34 16.13,66.33 5.7,66.36 7.41,66.36 9.13,66.36 10.85,66.36 24.5,66.31 26.21,66.31 27.93,66.31 17.5,66.34 19.21,66.34 20.93,66.33 22.65,66.33 9.72,80.02 11.43,80.02 16.71,80.02 18.43,80.02 4.33,66.38 0.98,70.88 1.08,74.49 1.08,79.77 1.09,76.21 1.09,77.93 0.98,69.28 0.98,67.78 4.38,80.02 2.58,80.02 13.03,77.32 23.13,72.22 10.33,73.42
  pour Top: 0.01,-0.1 29.9,-0.1 29.9,65 0.01,65
  pour Bottom: 0.01,0 29.9,0 29.9,65 0.01,65
  pour Top: 0.41,65.8 30,65.8 30,80.8 0.41,80.8
  pour Bottom: 0.51,65.9 30,65.9 30,80.8 0.51,80.8
  pour Bottom: 27.11,66 29,66 29,64.8 27,64.8 27,65.8
  pour Top: 27.4,66 27.2,65.8 27.2,65 28.7,65 28.7,66
LED  (via drill 0.3)
  Top 0.152: v20.24,38.1 20.39,37.95 21.14,37.95 21.49,37.65 21.49,33.38 21.14,33.03 21.14,32.05 21.02,31.92 20.61,31.92 20.43,31.77 19.45,31.77 U1.12 | v21.39,40.46 21.1,40.17 R1.4
  Bottom 0.152: v20.24,38.1 20.07,38.46 21.39,39.78 v21.39,40.46
MISO  (via drill 0.3)
  Top 0.152: 19.51,33.84 U1.16 19.24,33.89 19.24,35.25 19.66,35.67 v19.66,36.27 | v6.56,25.76 7.32,25 7.32,6.86 7.57,6.61 11.31,6.61 12.4,5.51 12.4,3.41 11.69,2.69 11.69,1.09 12.02,0.76 13.26,0.76 13.57,1.07 13.72,1.07 14.03,0.76 14.33,0.76 15.4,1.83 JP1.2 | J2.21 3.44,35.11 3.44,52.25 4.07,52.88 5.88,52.88 6.5,53.49 7.47,53.49 8,52.97 9.64,52.97 10.51,52.1 10.51,49.76 11.19,49.07 11.19,48.45 arc81 11.6,47.97 13.4,47.97 13.61,47.76 13.61,47.39 14.14,46.85 14.85,46.85 15.4,47.4 U4.2
  Bottom 0.152: v19.66,36.27 19.66,36.58 18.75,37.49 18.75,37.95 16.62,40.08 11.28,40.08 10.98,40.39 9.51,40.39 6.1,36.96 6.08,34.75 5.19,33.84 5.03,33.84 | 5.03,33.84 4.88,33.84 J2.21 | 5.03,33.84 J2.21 | v6.56,25.76 6.04,26.23 6.04,32.07 5.06,33.09 5.06,33.48 J2.21
MOSFET
  Top 0.152: Q1.1 10.06,68.25 C12.1 6.91,68.15 U$4.1
MOSI  (via drill 0.3)
  Top 0.152: v19.97,37.19 20.58,36.58 20.68,36.58 20.87,36.38 20.87,34.13 19.96,33.27 19.35,33.27 U1.15 | 12.81,1.96 12.81,1.98 | v3.97,27.43 5.19,27.43 5.64,26.98 6.25,26.98 7.62,25.61 7.62,7.17 7.85,6.94 11.97,6.94 12.81,6.1 12.81,1.98 | 12.81,1.98 JP1.1 | v3.5,58.09 3.78,58.36 16.82,58.36 18.36,56.83 18.36,55.24 U4.5
  Bottom 0.152: v19.97,37.19 16.77,40.39 11.44,40.39 11.13,40.69 9.3,40.69 5.8,37.19 5.64,37.19 5.19,37.65 4.42,37.65 4.05,37.27 | 4.05,37.27 3.51,36.73 3.51,32.46 4.73,31.24 J2.19 4.73,31.09 3.51,29.87 3.51,28.2 3.97,27.74 v3.97,27.43 | v3.5,58.09 3.5,37.81 4.05,37.27
N$1  (via drill 0.3)
  Top 0.152: LED1.3 27.59,61.57 27.59,61.02 27.23,60.67 25.47,60.67 24.17,59.36 24.17,53.17 20.74,49.74 | v16.62,46.03 16.62,45.98 17.33,45.27 17.61,45.27 17.81,45.06 18.42,45.06 18.72,44.76 18.72,42.34 18.32,41.94 18.32,41.44 R1.7 | v19.51,48.92 19.93,48.92 20.74,49.74 | 20.74,49.74
  Bottom 0.152: v19.51,48.92 v16.62,46.03
N$2
  Top 0.152: LED3.C 12.09,62.48 R4.1
N$3  (1 unrouted)
  Top 0.813: JP3.2 25.92,25.29 | 25.92,25.29 25.92,25.66 C5.1 | C4.1 26.01,25.38 25.92,25.29
N$4
  Top 0.152: LED1.2 26.52,61.57 26.37,61.42 25.76,61.42 23.82,59.48 23.82,53.42 21.07,50.67 21.07,50.65 21.07,50.64 19.99,49.56 18.85,49.56 18.58,49.3 18.58,47.75 17.68,46.85 17.68,45.65 17.96,45.37 18.57,45.37 19.1,44.84 R1.6 19.1,41.72
N$5  (via drill 0.3)
  Top 0.152: D3.+ 13.17,75.44 v14.81,73.8 | v15.51,71.2 15.51,70.3 D5.A
  Bottom 0.152: v14.81,73.8 14.81,71.9 v15.51,71.2
N$6
  Top 0.152: U1.7 18.14,29.42 18.14,28.81 17.33,28.1 17.18,28 17.08,27.54 Y1.3
N$7
  Top 0.152: LED2.C 9.49,62.47 R4.4
N$8
  Top 0.152: U1.8 18.65,28.82 19.51,28.05 19.51,27.35 19.56,26.7 19.46,27.39 Y1.1
N$9
  Top 0.152: LED4.C 15.2,62.44 15.16,62.44 14.4,63.2 11.41,63.2 11.18,62.98 R4.2
N$11  (via drill 0.3)
  Top 0.152: v9.36,29.37 9.15,29.37 U2.4
  Bottom 0.152: v9.36,29.37 9.14,29.28 JP2.2
N$12
  Top 0.152: J4.2 10.16,60.18 9.95,60.39 8.93,60.39 LED2.A
N$13  (via drill 0.3)
  Top 0.152: R1.8 17.38,41.53 16.95,41.53 v16.62,41.86 | LED5.A 21.41,47.71 22.47,46.66 22.48,46.66 LED6.C 22.85,46.12 v22.11,45.38
  Bottom 0.152: v16.62,41.86 16.62,41.89 17.49,41.89 20.99,45.39 v22.11,45.38
N$14  (via drill 0.5)
  other vias: 28.8,28.18
N$15
  Top 0.152: LED1.1 27.44,63.4 28.19,62.65 28.19,60.95 27.55,60.32 25.64,60.32 24.54,59.21 24.54,53 23.61,52.06 | R1.5 20.27,41.79 20.27,48.73 23.61,52.06 | 23.61,52.06 23.62,52.06
N$16  (via drill 0.5)
  other vias: 28.89,30.42
N$17  (via drill 0.5)
  other vias: 24.86,30.44
N$18  (via drill 0.5)
  other vias: 24.82,32.52
N$19  (via drill 0.5)
  other vias: 24.84,34.58
N$20  (via drill 0.5)
  other vias: 24.82,36.65
N$21  (via drill 0.5)
  other vias: 24.8,38.84
N$22  (via drill 0.5)
  other vias: 24.82,40.97
N$23  (via drill 0.5)
  other vias: 24.79,43.11
N$24  (via drill 0.5)
  other vias: 24.82,45.23
N$25
  pour Top: 1.3,64.9 3.71,64.9 3.71,65.3 3.71,65.8 3.3,66.2 3.21,66.3 1.7,66.3 1.4,66 1.4,65.8 1.3,65.7
N$26  (via drill 0.5)
  other vias: 25.9,28.16
N$27  (via drill 0.5)
  other vias: 28.84,32.5
N$28  (via drill 0.5)
  other vias: 28.86,34.57
N$29  (via drill 0.5)
  other vias: 28.83,36.65
N$30  (via drill 0.5)
  other vias: 28.8,38.83
N$31  (via drill 0.5)
  other vias: 28.81,40.96
N$32  (via drill 0.5)
  other vias: 28.78,43.11
N$33  (via drill 0.5)
  other vias: 28.83,45.23
N$34
  pour Bottom: 1.5,65 3.6,65 3.6,66 3.4,66.2 1.7,66.2 1.6,66.1 1.5,66
N$35
  Top 1: 25.94,28.14 25.91,28.14
OUTA  (via drill 0.3)
  Top 0.152: U1.14 19.51,32.77 19.97,32.77 21.18,33.98 21.18,36.76 20.88,37.05 v20.88,37.19 | v12.11,59.8 12.24,59.8 LED3.A | v22.18,60.65 20.01,60.65 19.68,60.31 X3.3
  Bottom 0.152: 26.37,55.78 26.37,58.37 26.02,58.73 25.07,58.73 23.2,60.6 22.23,60.6 v22.18,60.65 | v20.88,37.19 20.88,38.68 22.4,40.2 22.4,40.22 23.03,40.84 23.03,42.17 23.39,42.53 23.39,43.33 23.05,43.66 23.03,51.03 23.5,51.5 25.81,51.5 26.37,52.05 26.37,55.78 | X3.3 18.02,57.3 13.71,57.3 12.11,58.89 v12.11,59.8 12.11,61.95 11.86,62.19 2.58,62.19 2.19,61.8 2.19,58.92 2.21,58.9 2.21,58.8 1,57.6 1,55.32 J2.38 | 26.37,55.78
OUTB  (via drill 0.3)
  Top 0.152: LED4.A 15.32,60.91 v14.31,59.9 | U1.11 19.97,31.25 20.26,30.97 21.13,30.45 22.34,30.45 22.83,30.95 22.83,34.61 22.83,34.62 22.83,34.71 23.28,35.16 23.28,35.77 23,36.05 23.02,36.07 23.02,41.5 22.33,42.18 21.88,42.18 21.88,43.13 v21.52,43.49 | v22.01,56.7 21.98,56.7 21.09,57.59 21.09,58.87 X3.2 | v2.63,63.09 2.63,62.89 3.62,61.9 3.62,60.08 v3.33,59.79
  Bottom 0.152: X3.2 21.15,60.55 20.3,61.4 16.8,61.4 16.01,60.61 16.01,59.91 16.01,59.9 v14.31,59.9 14.31,62.02 13.58,62.75 3.09,62.75 3.08,62.74 2.98,62.74 v2.63,63.09 | 20.84,49.05 20.99,49.2 | 20.99,49.2 22.01,50.22 v22.01,56.7 | v3.33,59.79 3.33,59.43 2.05,58.15 2.05,56.81 J2.40 | 20.99,49.2 22.31,47.87 22.35,47.87 22.72,47.51 22.72,43.71 22.5,43.49 v21.52,43.49
PUSH  (via drill 0.3)  (1 unrouted)
  Top 0.152: v14.79,28.04 14.48,28.35 15.09,28.96 15.09,29.42 U1.1 | SPK1.+ 20.71,50.87 23.14,53.31 23.14,54.01 v23.19,54.05 | 25.71,52.48 v25.54,52.66 24.68,52.66 20.65,48.63 20.65,41.84 20.78,41.71 22.18,41.71 22.7,41.19 22.7,39.07 22.4,38.78 v22.37,38.92
  Bottom 0.152: v14.79,28.04 14.79,29.87 19.74,34.79 19.96,34.98 20.59,34.98 21.58,35.97 21.57,38.06 v22.37,38.92 | v22.37,38.92 22.38,38.94 | v23.19,54.05 25.2,54.05 25.79,53.46 25.79,53.19 25.54,52.93 v25.54,52.66 | 22.4,38.87 v22.37,38.92
RIRQ  (via drill 0.3)
  Top 0.152: v14.18,21.95 14.18,30.03 14.33,30.18 U1.32 | v14.16,10.39 14.18,6.86 15.55,5.49 15.55,4.73 15.7,4.57 U$1.IRQ
  Bottom 0.152: v14.16,10.39 v14.18,21.95
RSCK
  Top 0.152: U1.2 15.55,29.42 15.55,28.96 15.25,28.65 15.25,28.5 15.4,28.35 15.4,27.66 14.55,26.81 14.55,22.61 14.83,22.33 14.83,21.73 15.4,21.16 15.4,20.88 15.7,20.58 U$1.SCK
RSDI  (via drill 0.3)
  Top 0.152: v18.14,21.64 17.99,21.49 17.99,20.73 17.84,20.58 U$1.SDI | U1.9 19.51,30.18 19.51,30.03 19.66,29.87 19.66,29.42 19.89,29.19 v20.59,29.19
  Bottom 0.152: v18.14,21.64 19.63,21.64 20.27,22.29 20.27,28.87 v20.59,29.19
RSDO  (via drill 0.3)
  Top 0.152: v20.43,30.18 19.88,30.71 19.42,30.71 U1.10 | v13.44,9.5 13.42,4.88 13.72,4.57 U$1.SDO
  Bottom 0.152: v20.43,30.18 20.43,29.87 13.42,22.86 v13.44,9.5
RSEL
  Top 0.152: 13.57,20.73 13.72,20.58 U$1.SEL 13.75,21.16 13.51,21.4 13.51,24.9 13.25,25.16 12.89,25.16 12.32,25.72 12.32,26.55 11.98,26.91 11.98,29.01 11.72,29.26 11.44,29.26 11.42,29.25 10.89,29.25 9.85,30.3 9.85,32.5 10.2,32.85 11.57,32.85 11.83,33.1 13.41,33.1 13.51,33.2 14.33,33.2 U1.26 14.13,33.18
RST  (via drill 0.3)
  Top 0.152: R7.2 11.44,39.93 10.83,39.93 v10.47,39.78 10.79,40.1 10.79,41.77 11.08,42.05 11.09,42.05 11.94,42.9 12.61,42.9 v13.11,43.4 | U1.29 13.16,31.75 12.31,30.9 12.31,27.2 12.71,26.8 12.71,26.6 v13.01,26.3 | v15.22,8.74 15.34,8.62 v15.34,6.79 | v12.59,52.49 12.78,52.68 12.78,54.26 v13.12,54.6 | U$2.P$1 25.76,58.58 v25.76,58.07
  Bottom 0.152: v10.47,39.78 16.46,39.78 18.45,37.8 18.45,37.23 17.23,36.13 17.22,35.34 18.45,34.11 18.45,33.99 13.57,29.11 13.57,26.3 | 13.57,26.3 13.57,24.54 13.36,24.54 9.95,21.13 9.95,19.76 8.15,17.96 8.15,16.37 7.85,16.07 5.1,16.07 4.88,15.85 J2.7 4.73,15.85 3.51,14.63 3.51,10.08 3.92,9.68 5.33,9.68 6.08,8.92 8.37,8.92 9.04,8.25 11.78,8.25 12.27,8.74 v15.22,8.74 | JP1.4 20.43,1.98 15.86,6.56 15.58,6.56 v15.34,6.79 | v13.01,26.3 13.57,26.3 | v13.11,43.4 13.11,45.1 12.59,45.62 v12.59,52.49 | v25.76,58.07 25.74,58.05 21.29,58.05 21.11,57.87 21.11,56.4 20.36,55.65 13.49,55.65 13.12,55.27 v13.12,54.6
RXD  (via drill 0.3)
  Top 0.152: v12.96,27.59 12.81,27.74 12.81,30.63 13.42,31.24 14.33,31.24 U1.30 | v17.84,37.54 17.84,38.41 19.1,39.67 R1.3
  Bottom 0.152: J2.8 2.29,16 3.51,17.22 3.51,19.05 4.27,19.81 5.19,19.81 v12.96,27.59 12.96,28.96 17.84,33.84 17.84,34.07 16.86,35.05 16.86,36.28 17.84,37.31 v17.84,37.54
SCK  (via drill 0.3)
  Top 0.152: 5.19,36.43 4.88,36.43 J2.23 5.45,36.31 6.05,36.91 6.05,40.41 6.71,41.08 7.71,41.08 8.29,40.49 9.71,40.49 10.41,41.2 10.41,43.1 10.67,43.36 10.67,43.37 12.11,44.8 13.43,44.8 | U1.17 18.6,34.6 18.6,35.21 19.18,35.79 19.18,35.94 19.03,36.09 19.03,36.51 19.14,36.62 19.14,36.99 18.77,37.36 | v20.73,5.49 20.73,3.81 20.43,3.51 19.66,3.51 18.14,1.98 JP1.3 | v21.8,32.77 21.8,37.89 20.8,38.73 19.75,38.73 19.22,38.24 19.21,37.8 18.77,37.36 | 18.77,37.36 18.33,36.93 17.49,36.93 17.25,37.17 17.25,38.03 v16.95,38.38 | 13.43,44.8 13.91,44.8 15.52,43.18 v15.52,39.12 | v14.8,56.55 14.86,56.49 15.48,56.49 15.88,56.09 16.36,56.09 16.67,55.79 U4.6 | v13.42,45.79 13.43,44.8
  Bottom 0.152: v20.73,5.49 20.73,28.35 21.8,29.42 v21.8,32.77 | v16.95,38.38 16.31,38.41 v15.52,39.12 | v13.42,45.79 13,46.19 13.01,47.2 13.2,47.39 13.2,51.35 13.49,51.64 13.49,53.15 13.3,53.34 12.53,53.34 12.34,53.53 12.34,55.52 13.37,56.55 v14.8,56.55
SCL  (via drill 0.3)
  Top 0.152: v11.58,37 11.59,38.1 R7.4 11.54,38.17 v10.33,38.16 9.9,37.73 X2.P$8 | U1.28 14.3,32.27 12.99,32.27 12.31,31.6 12.14,31.6 v11.73,31.2 | 5.19,13.57 4.88,13.57 J2.5 5.01,13.45 6.02,14.46 6.02,16.52 5.57,16.98 5.57,17.42 5.99,17.84 5.99,19.16 5.54,19.61 5.54,20.18 6.09,20.72 6.09,21.59 6.71,22.21 v6.71,24.23 | U2.1 7.61,27.05 v7.98,26.66 | 6.89,60.9 IC1.SCL arc-90 6.86,60.83 4.95,60.83 v4.34,61.44 | v8.72,38.29 8.49,38.29 v6.75,40.08
  Bottom 0.152: 8.4,26.23 6.71,24.54 v6.71,24.23 | 8.4,26.23 10.21,28.03 10.21,30.63 10.78,31.2 v11.73,31.2 12.4,31.2 13.72,32.52 13.72,34.18 12.36,35.54 12.36,36.57 v11.58,37 | J2.5 5.98,12.25 CN1.2 | v7.98,26.66 v7.98,26.65 8.4,26.23 | v10.33,38.16 8.75,38.17 v8.72,38.29 | v6.75,40.08 6.77,40.09 6.9,40.08 6.76,40.08 6.15,40.69 6.15,42.73 6.15,42.74 6.15,47.81 6.14,47.82 6.14,57.82 5.92,58.03 4.99,58.03 4.26,58.76 4.26,61.36 v4.34,61.44
SDA  (via drill 0.3)
  Top 0.152: 6.08,33.36 5.19,32.46 4.27,32.46 3.51,31.7 3.51,27.89 3.36,27.74 3.36,26.82 3.51,26.67 3.51,12.19 4.73,10.98 J2.3 | R7.3 11.44,39.02 11.13,39.02 11.04,39.05 10.73,39.05 10.66,39.05 10.27,39.05 | U1.27 14.33,32.77 12.27,32.77 v11.81,32.3 | U2.6 7.62,29.41 v7.29,29.74 | IC1.SDA v5.36,60.24 v5.36,60.23 | v7.79,40.01 9.29,40.04 10.27,39.06 10.27,39.05 | 10.27,39.05 10.15,39.17 9.38,38.39 9.38,38.07 8.69,37.38 8.23,37.38 | 8.23,37.38 7.77,37.38 7.47,37.08 7.47,36.24 7.2,35.96 6.45,35.96 6.08,35.59 6.08,33.36 | X2.P$1 8.23,36.68 8.23,37.38 | v6.62,32.75 6.62,32.83 6.08,33.36
  Bottom 0.152: v11.81,32.3 11.11,31.6 7.6,31.6 7.3,31.9 | J2.3 5.98,9.71 CN1.1 | v7.29,29.74 7.29,31.89 7.3,31.9 | v5.36,60.23 5.1,59.97 5.1,59.23 5.74,58.59 7.23,58.59 7.51,58.31 7.51,51.05 7.5,51.04 7.5,40.29 v7.79,40.01 | v6.62,32.75 7.3,32.07 7.3,31.9
TXD  (via drill 0.3)
  Top 0.152: v13.42,30.33 13.79,30.71 14.4,30.71 U1.31 | v14.18,37.95 14.64,38.41 15.91,38.41 16.77,39.27 17.99,39.27 18.29,39.58 R1.2
  Bottom 0.152: J2.10 2.29,18.6 3.51,19.81 3.51,21.49 4.27,22.25 5.19,22.25 5.8,22.86 6.25,22.86 7.71,22.9 12.21,27.4 12.21,27.8 12.61,28.2 12.61,29.21 13.42,30.03 v13.42,30.33 14.18,31.09 14.18,34.36 13.88,34.66 13.88,35.81 13.53,36.15 13.53,36.73 14.18,37.38 v14.18,37.95
USB_D+  (via drill 0.3)
  Top 0.152: R2.1 11.13,23.36 | 11.13,23.36 D2.C 10.31,24.17 | J3.D+ 5.31,6.49 5.85,7.06 6.74,7.06 7,7.32 7,19.9 6.95,19.94 v6.52,19.94 | v9.62,22.13 10.67,22.14 10.9,22.37 10.9,23.13 11.13,23.36
  Bottom 0.152: v6.52,19.94 8.72,22.14 v9.62,22.13
USB_D-  (via drill 0.3)
  Top 0.152: J3.D- 4.66,6.36 5.58,7.29 5.59,7.29 5.7,7.4 6.42,7.4 6.67,7.65 6.67,16.83 v6.29,17.21 | D1.C 8.27,23.47 8.27,20.64 8.57,20.34 v8.96,20.34 8.97,20.33 8.97,19.79 9.15,19.61 12.67,19.61 12.92,19.36 16.48,19.36 16.75,19.63 16.75,21.94 R5.1 arc90 17.45,22.69 R3.1
  Bottom 0.152: v6.29,17.21 6.29,17.69 8.65,20.05 8.67,20.05 v8.96,20.34
XTAL1
  Top 0.152: C8.1 17.06,26.22 Y2.P$2
XTAL2
  Top 0.152: C10.1 19.56,26.4 Y2.P$1
(copper drawn outside any net)
  shapes: Top area x1

### Text on the board
tPlace: AD1582 | On | OutA | OutB | RST | Act | Radio | Tx | Rx | DotPhat v3.2.3 | 08.2018 | GND | SDA | GND | MOSI
bPlace: Mihai Galos